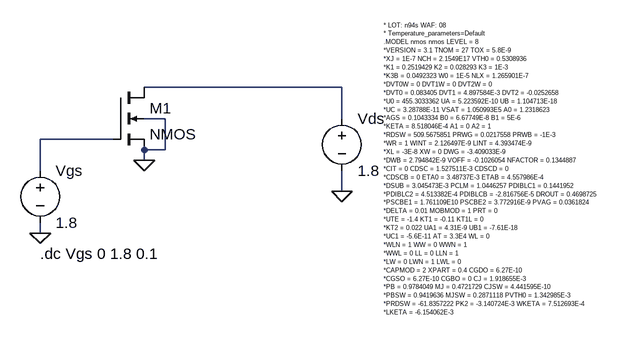
[diagram p0: schematic NMOS.asc]
NMOS.asc, the LTspice schematic file:
Version 4
SHEET 1 1332 1064
WIRE 416 192 112 192
WIRE 144 240 112 240
WIRE 416 240 416 192
WIRE 64 272 -48 272
WIRE 144 288 144 240
WIRE 144 288 112 288
WIRE 112 304 112 288
WIRE -48 320 -48 272
WIRE 416 352 416 320
WIRE -48 416 -48 400
FLAG 112 304 0
FLAG -48 416 0
FLAG 416 352 0
SYMBOL nmos4 64 192 R0
SYMATTR InstName M1
SYMATTR Value2 l=180nm
SYMBOL voltage 416 224 R0
SYMATTR InstName Vds
SYMATTR Value 1.8
SYMBOL voltage -48 304 R0
WINDOW 123 0 0 Left 0
WINDOW 39 0 0 Left 0
SYMATTR InstName Vgs
SYMATTR Value 1.8
TEXT -48 448 Left 2 !.dc Vgs 0 1.8 0.1
TEXT 480 96 Left 0 !* LOT: n94s WAF: 08\n* Temperature_parameters=Default\n.MODEL nmos nmos LEVEL = 8\n*VERSION = 3.1 TNOM = 27 TOX = 5.8E-9\n*XJ = 1E-7 NCH = 2.1549E17 VTH0 = 0.5308936\n*K1 = 0.2519429 K2 = 0.028293 K3 = 1E-3\n*K3B = 0.0492323 W0 = 1E-5 NLX = 1.265901E-7\n*DVT0W = 0 DVT1W = 0 DVT2W = 0\n*DVT0 = 0.083405 DVT1 = 4.897584E-3 DVT2 = -0.0252658\n*U0 = 455.3033362 UA = 5.223592E-10 UB = 1.104713E-18\n*UC = 3.28788E-11 VSAT = 1.050993E5 A0 = 1.2318623\n*AGS = 0.1043334 B0 = 6.67749E-8 B1 = 5E-6\n*KETA = 8.518046E-4 A1 = 0 A2 = 1\n*RDSW = 509.5675851 PRWG = 0.0217558 PRWB = -1E-3\n*WR = 1 WINT = 2.126497E-9 LINT = 4.393474E-9\n*XL = -3E-8 XW = 0 DWG = -3.409033E-9\n*DWB = 2.794842E-9 VOFF = -0.1026054 NFACTOR = 0.1344887\n*CIT = 0 CDSC = 1.527511E-3 CDSCD = 0\n*CDSCB = 0 ETA0 = 3.48737E-3 ETAB = 4.557986E-4\n*DSUB = 3.045473E-3 PCLM = 1.0446257 PDIBLC1 = 0.1441952\n*PDIBLC2 = 4.513382E-4 PDIBLCB = -2.816756E-5 DROUT = 0.4698725\n*PSCBE1 = 1.761109E10 PSCBE2 = 3.772916E-9 PVAG = 0.0361824\n*DELTA = 0.01 MOBMOD = 1 PRT = 0\n*UTE = -1.4 KT1 = -0.11 KT1L = 0\n*KT2 = 0.022 UA1 = 4.31E-9 UB1 = -7.61E-18\n*UC1 = -5.6E-11 AT = 3.3E4 WL = 0\n*WLN = 1 WW = 0 WWN = 1\n*WWL = 0 LL = 0 LLN = 1\n*LW = 0 LWN = 1 LWL = 0\n*CAPMOD = 2 XPART = 0.4 CGDO = 6.27E-10\n*CGSO = 6.27E-10 CGBO = 0 CJ = 1.918655E-3\n*PB = 0.9784049 MJ = 0.4721729 CJSW = 4.441595E-10\n*PBSW = 0.9419636 MJSW = 0.2871118 PVTH0 = 1.342985E-3\n*PRDSW = -61.8357222 PK2 = -3.140724E-3 WKETA = 7.512693E-4\n*LKETA = -6.154062E-3

The netlist it stands for:
* NMOS.asc
M1 N001 N002 0 0 NMOS l=180nm
Vds N001 0 1.8
Vgs N002 0 1.8
.model NMOS NMOS
.model PMOS PMOS
.lib standard.mos
.dc Vgs 0 1.8 0.1
* LOT: n94s WAF: 08
* Temperature_parameters=Default
.MODEL nmos nmos LEVEL = 8
*VERSION = 3.1 TNOM = 27 TOX = 5.8E-9
*XJ = 1E-7 NCH = 2.1549E17 VTH0 = 0.5308936
*K1 = 0.2519429 K2 = 0.028293 K3 = 1E-3
*K3B = 0.0492323 W0 = 1E-5 NLX = 1.265901E-7
*DVT0W = 0 DVT1W = 0 DVT2W = 0
*DVT0 = 0.083405 DVT1 = 4.897584E-3 DVT2 = -0.0252658
*U0 = 455.3033362 UA = 5.223592E-10 UB = 1.104713E-18
*UC = 3.28788E-11 VSAT = 1.050993E5 A0 = 1.2318623
*AGS = 0.1043334 B0 = 6.67749E-8 B1 = 5E-6
*KETA = 8.518046E-4 A1 = 0 A2 = 1
*RDSW = 509.5675851 PRWG = 0.0217558 PRWB = -1E-3
*WR = 1 WINT = 2.126497E-9 LINT = 4.393474E-9
*XL = -3E-8 XW = 0 DWG = -3.409033E-9
*DWB = 2.794842E-9 VOFF = -0.1026054 NFACTOR = 0.1344887
*CIT = 0 CDSC = 1.527511E-3 CDSCD = 0
*CDSCB = 0 ETA0 = 3.48737E-3 ETAB = 4.557986E-4
*DSUB = 3.045473E-3 PCLM = 1.0446257 PDIBLC1 = 0.1441952
*PDIBLC2 = 4.513382E-4 PDIBLCB = -2.816756E-5 DROUT = 0.4698725
*PSCBE1 = 1.761109E10 PSCBE2 = 3.772916E-9 PVAG = 0.0361824
*DELTA = 0.01 MOBMOD = 1 PRT = 0
*UTE = -1.4 KT1 = -0.11 KT1L = 0
*KT2 = 0.022 UA1 = 4.31E-9 UB1 = -7.61E-18
*UC1 = -5.6E-11 AT = 3.3E4 WL = 0
*WLN = 1 WW = 0 WWN = 1
*WWL = 0 LL = 0 LLN = 1
*LW = 0 LWN = 1 LWL = 0
*CAPMOD = 2 XPART = 0.4 CGDO = 6.27E-10
*CGSO = 6.27E-10 CGBO = 0 CJ = 1.918655E-3
*PB = 0.9784049 MJ = 0.4721729 CJSW = 4.441595E-10
*PBSW = 0.9419636 MJSW = 0.2871118 PVTH0 = 1.342985E-3
*PRDSW = -61.8357222 PK2 = -3.140724E-3 WKETA = 7.512693E-4
*LKETA = -6.154062E-3
.backanno
.end